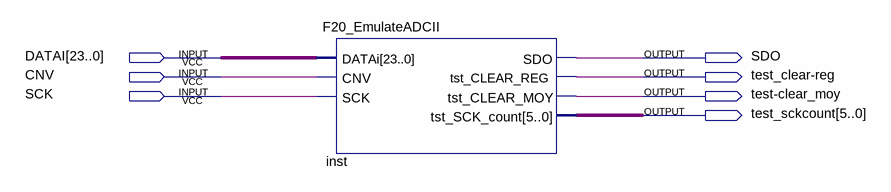
[diagram p0: schematic sheet]
// Quartus schematic Test_F20II.bdf as structural Verilog: 1 symbols, 7 pins
module Test_F20II (
  input  [23:0] DATAI,
  input  CNV,
  input  SCK,
  output SDO,
  output \test_clear-reg ,
  output \test-clear_moy ,
  output [5:0] test_sckcount
);

  F20_EmulateADCII inst (
    .DATAi(DATAI), .CNV(CNV), .SCK(SCK), .SDO(SDO), .tst_CLEAR_REG(\test_clear-reg ),
    .tst_CLEAR_MOY(\test-clear_moy ), .tst_SCK_count(test_sckcount));
endmodule
